# EasyEDA schematic SCH_AQUVIS-Embedded_2023-07-29.json
TITLE: Embedded; REV: 3.1; Date: 2023-07-14; Sheet: 2/2; Drawn By: Shreesh Bajpai; Company: PIL
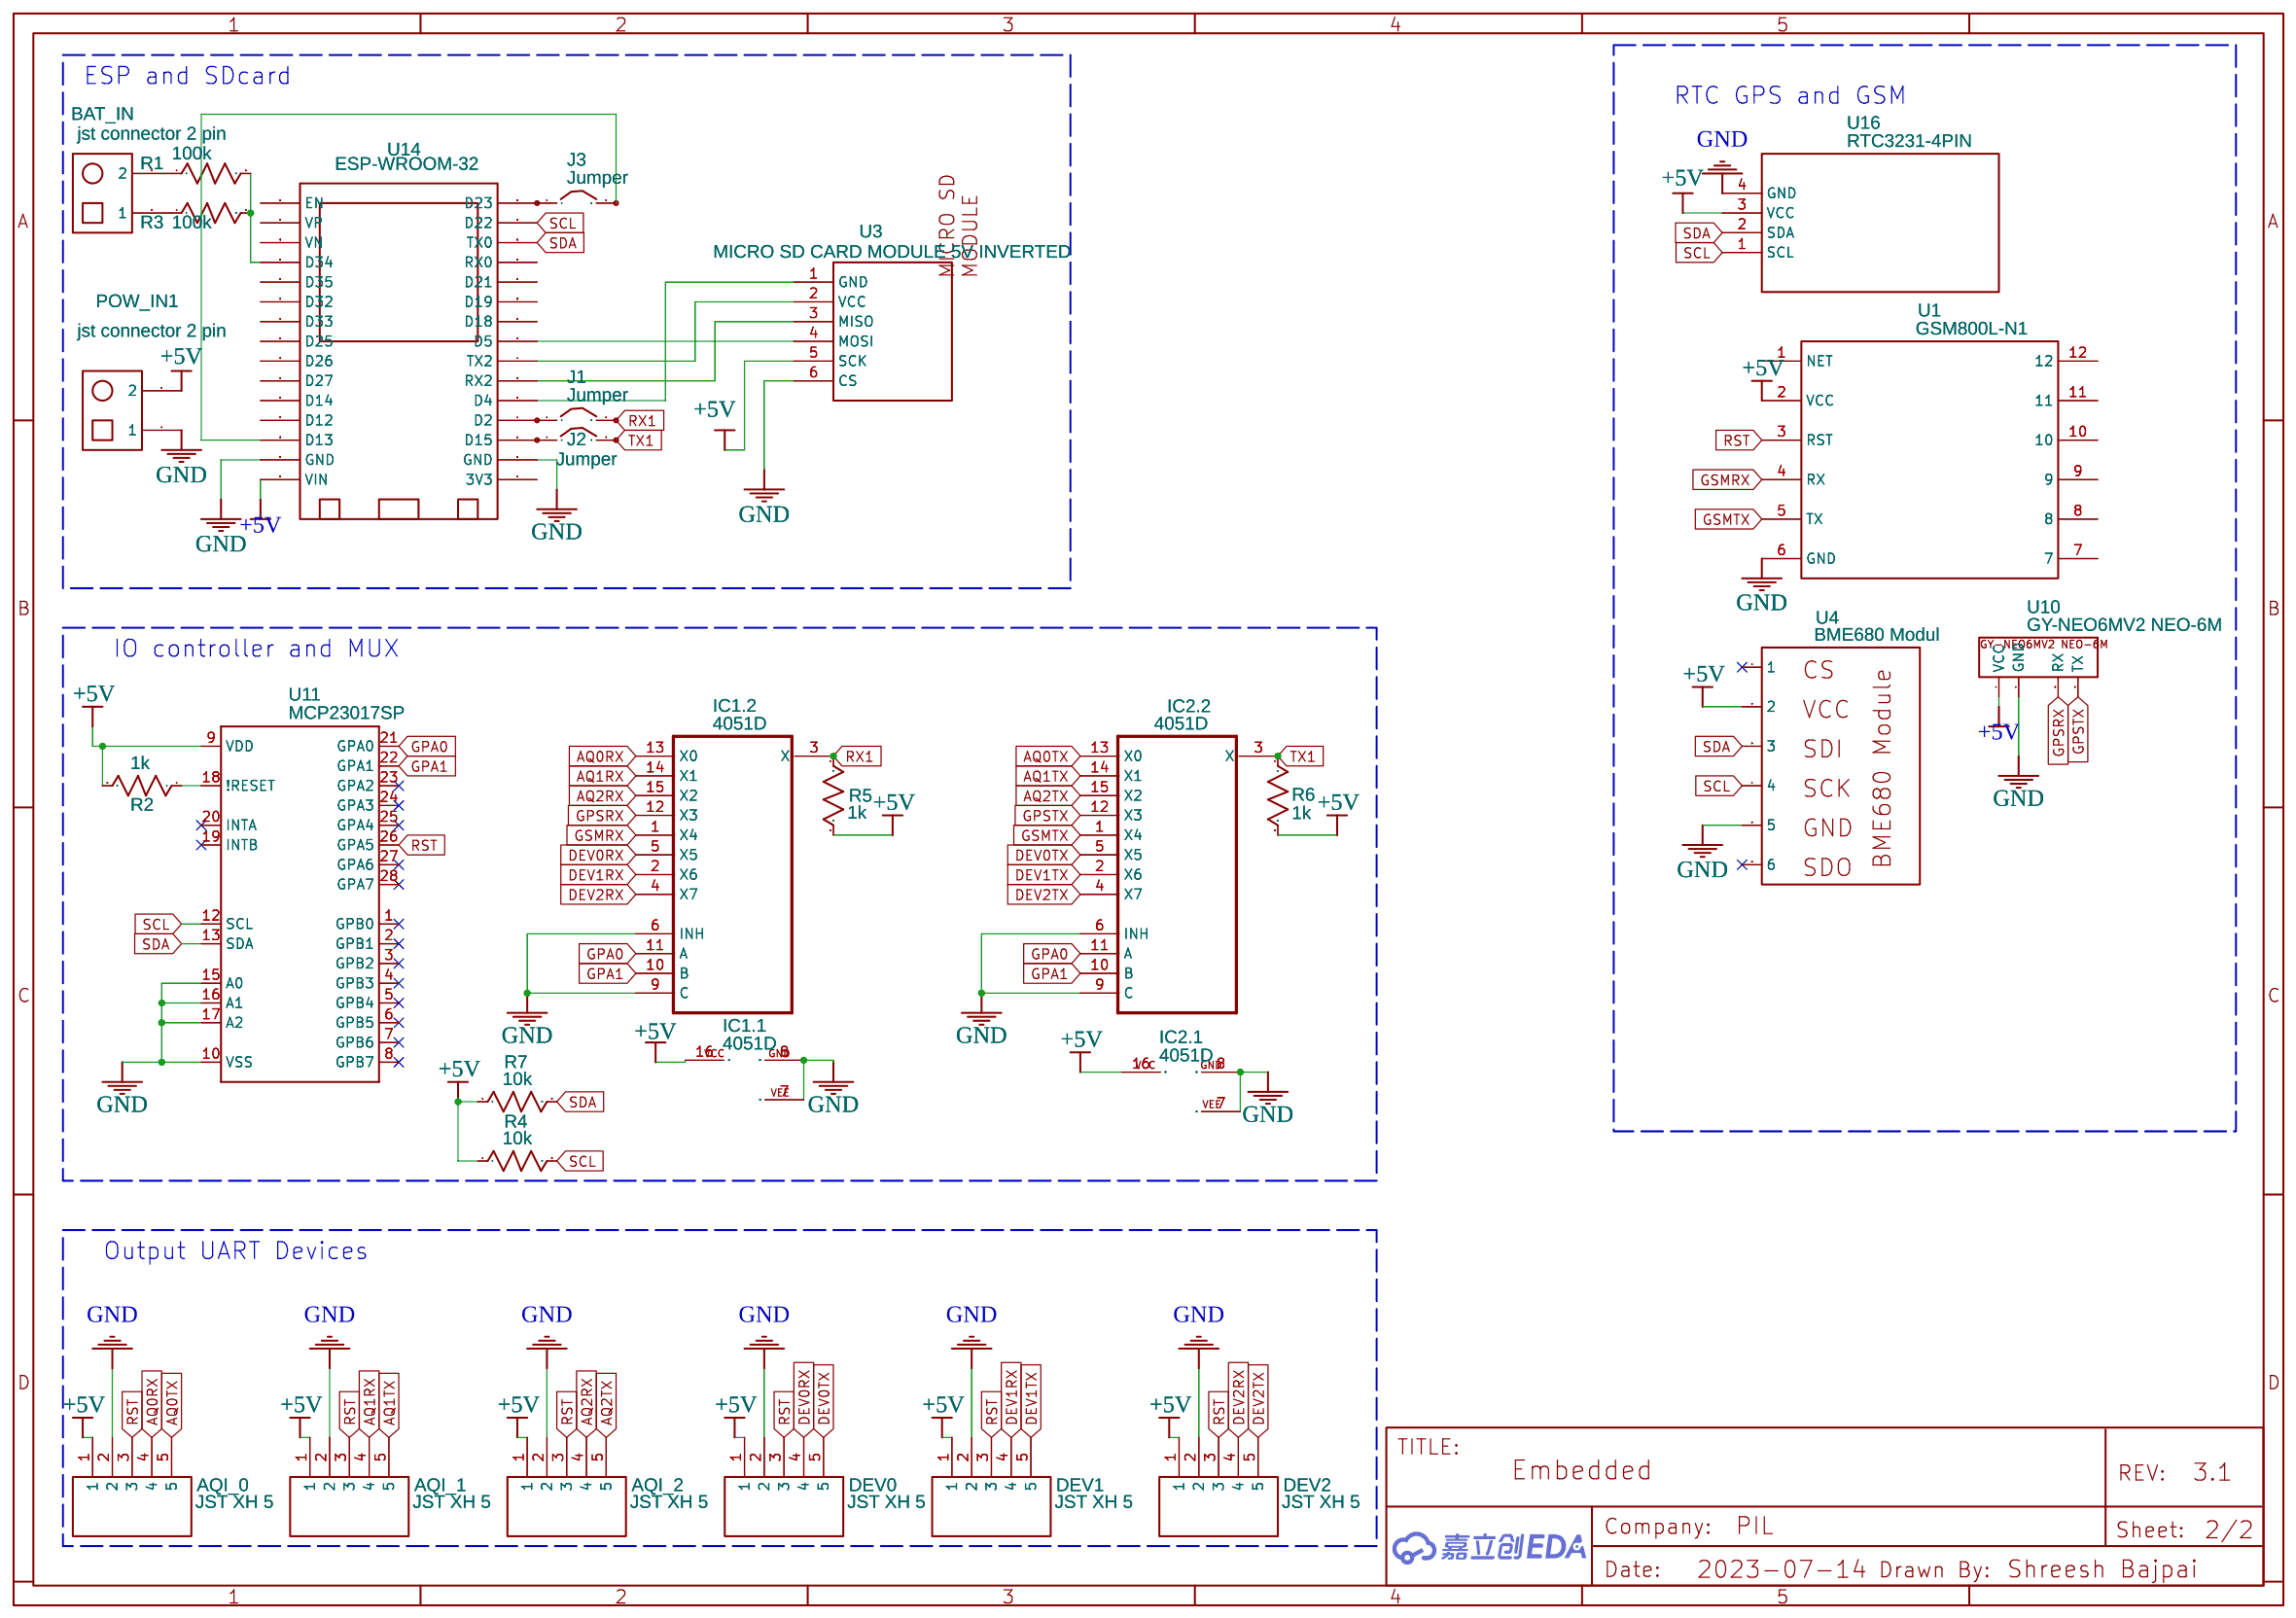
[diagram p0: schematic sheet]

## Parts
AQI_0  JST XH 5  [JST-XH-5PIN]
AQI_1  JST XH 5  [JST-XH-5PIN]
AQI_2  JST XH 5  [JST-XH-5PIN]
BAT_IN  jst connector 2 pin  [JST_XH_02X2.50MM]
DEV0  JST XH 5  [JST-XH-5PIN]
DEV1  JST XH 5  [JST-XH-5PIN]
DEV2  JST XH 5  [JST-XH-5PIN]
IC1  4051D  [SO16]  (sections 1,2)
IC2  4051D  [SO16]  (sections 1,2)
J1  Jumper  [HDR-TH_2P-P2.54-V-M-1]
J2  Jumper  [HDR-TH_2P-P2.54-V-M-1]
J3  Jumper  [HDR-TH_2P-P2.54-V-M-1]
POW_IN1  jst connector 2 pin  [JST_XH_02X2.50MM]
R1  100k  [R_AXIAL-0.3]
R2  1k  [R_AXIAL-0.3]
R3  100k  [R_AXIAL-0.3]
R4  10k  [R_AXIAL-0.3]
R5  1k  [R_AXIAL-0.3]
R6  1k  [R_AXIAL-0.3]
R7  10k  [R_AXIAL-0.3]
U1  GSM800L-N1  [GSM800L-N1]
U3  MICRO SD CARD MODULE 5V INVERTED  [MICRO SD CARD MODULE_INVERTED]
U4  BME680 Modul  [BME680 MODUL]
U10  GY-NEO6MV2 NEO-6M  [GY-NEO6MV2 NEO-6M]
U11  MCP23017SP  [DIL28-3]
U14  ESP-WROOM-32  [ESP-WROOM-32 ESP32 ESP-32S_FOOTPRINT]
U16  RTC3231-4PIN  [RTC3231-4PIN]

## Library data of the parts
AQI_0-AQI_2 DEV0-DEV2 = JST XH 5: Contributor: Guest
BAT_IN POW_IN1 = jst connector 2 pin: Manufacturer Part: JST_XH CONNECTOR; link: https://nl.aliexpress.com/item/50-sets-Kit-in-doos-2-p-3-p-4-pin-2-54mm-Pitch-Terminal-Behuizing/32681086028.html?spm=a2g0s.9042311.0.0.I0g15Z; Contributor: j.arts87
IC1 IC2 = 4051D: Contributor: Trajectory; subpart_no: 1
J1-J3 = JUMPERTHRUHOLE: Supplier Part: NONE; Manufacturer: NONE; Manufacturer Part: NONE; Contributor: yang tom
R1-R7 = R_AXIAL-0.3_US: Contributor: LCEDA_Lib
U1 = GSM800L-N1: Supplier: ROKKHI; Contributor: vivek1308
U3 = MICRO SD CARD MODULE 5V INVERTED: Contributor: RockTeam
U4 = BME680 Modul: Supplier: Reichelt; Contributor: wolle_knolle
U10 = GY-NEO6MV2 NEO-6M: Contributor: franco.fumanti
U11 = MCP23017SP: http:ww1.microchip.comdownloadsenDeviceDoc21952a.pdf
U14 = ESP-WROOM-32: Manufacturer: HiLetgo; Manufacturer Part: 3-01-1287; Supplier: HiLetgo; Supplier Part: 3-01-1287; link: https://www.amazon.com/HiLetgo-ESP-WROOM-32-Development-Microcontroller-Integrated/dp/B0718T232Z/ref=sr_1_4?crid=1EU2H9U0SA0FH&keywords=esp32&qid=1658284464&sprefix=esp32%2Caps%2C117&sr=8-4; Contributor: yuvi_dew
U16 = RTC3231-4PIN: Contributor: Roquefort

## Nets
+5V: AQI_0.1 AQI_1.1 AQI_2.1 DEV0.1 DEV1.1 DEV2.1 IC1.16(VCC) IC2.16(VCC) POW_IN1.2 R2.2 R4.1 R5.2 R6.2 R7.1 U1.2(VCC) U3.5(SCK) U4.2 U10.4(VCC) U11.9(VDD) U14.30(VIN) U16.3(VCC)
GND: AQI_0.2 AQI_1.2 AQI_2.2 DEV0.2 DEV1.2 DEV2.2 IC1.6(INH) IC1.7(VEE) IC1.8(GND) IC1.9(C) IC2.6(INH) IC2.7(VEE) IC2.8(GND) IC2.9(C) POW_IN1.1 U1.6(GND) U3.6(CS) U4.5 U10.1(GND) U11.10(VSS) U11.15(A0) U11.16(A1) U11.17(A2) U14.2(GND) U14.29(GND) U16.4(GND)
AQ0RX: AQI_0.4 IC1.13(X0)
AQ0TX: AQI_0.5 IC2.13(X0)
AQ1RX: AQI_1.4 IC1.14(X1)
AQ1TX: AQI_1.5 IC2.14(X1)
AQ2RX: AQI_2.4 IC1.15(X2)
AQ2TX: AQI_2.5 IC2.15(X2)
DEV0RX: DEV0.4 IC1.5(X5)
DEV0TX: DEV0.5 IC2.5(X5)
DEV1RX: DEV1.4 IC1.2(X6)
DEV1TX: DEV1.5 IC2.2(X6)
DEV2RX: DEV2.4 IC1.4(X7)
DEV2TX: DEV2.5 IC2.4(X7)
GPA0: IC1.11(A) IC2.11(A) U11.21(GPA0)
GPA1: IC1.10(B) IC2.10(B) U11.22(GPA1)
GPSRX: IC1.12(X3) U10.3(RX)
GPSTX: IC2.12(X3) U10.2(TX)
GSMRX: IC1.1(X4) U1.4(RX)
GSMTX: IC2.1(X4) U1.5(TX)
RST: AQI_0.3 AQI_1.3 AQI_2.3 DEV0.3 DEV1.3 DEV2.3 U1.3(RST) U11.26(GPA5)
RX1: IC1.3(X) J1.2 R5.1
SCL: R4.2 U4.4 U11.12(SCL) U14.14(D22) U16.1(SCL)
SDA: R7.2 U4.3 U11.13(SDA) U14.13(TX0) U16.2(SDA)
TX1: IC2.3(X) J2.2 R6.1
Net-(BAT_IN-1): BAT_IN.1 R3.1
Net-(BAT_IN-2): BAT_IN.2 R1.1
Net-(J1-1): J1.1 U14.4(D2)
Net-(J2-1): J2.1 U14.3(D15)
Net-(J3-1): J3.1 U14.15(D23)
Net-(J3-2): J3.2 U14.28(D13)
Net-(R1-2): R1.2 R3.2 U14.19(D34)
Net-(R2-1): R2.1 U11.18(!RESET)
Net-(U3-1): U3.1(GND) U14.5(D4)
Net-(U3-2): U3.2(VCC) U14.7(TX2)
Net-(U3-3): U3.3(MISO) U14.6(RX2)
Net-(U3-4): U3.4(MOSI) U14.8(D5)

Not connected (* = marked no-connect by the designer): U1 1(NET) 7 8 9 10 11 12; U4 1* 6*; U11 1(GPB0)* 2(GPB1)* 3(GPB2)* 4(GPB3)* 5(GPB4)* 6(GPB5)* 7(GPB6)* 8(GPB7)* 19(INTB)* 20(INTA)* 23(GPA2)* 24(GPA3)* 25(GPA4)* 27(GPA6)* 28(GPA7)*; U14 1(3V3) 9(D18) 10(D19) 11(D21) 12(RX0) 16(EN) 17(VP) 18(VN) 20(D35) 21(D32) 22(D33) 23(D25) 24(D26) 25(D27) 26(D14) 27(D12)

## Notes on the sheet
- ESP and SDcard
- RTC GPS and GSM
- IO controller and MUX
- Output UART Devices
